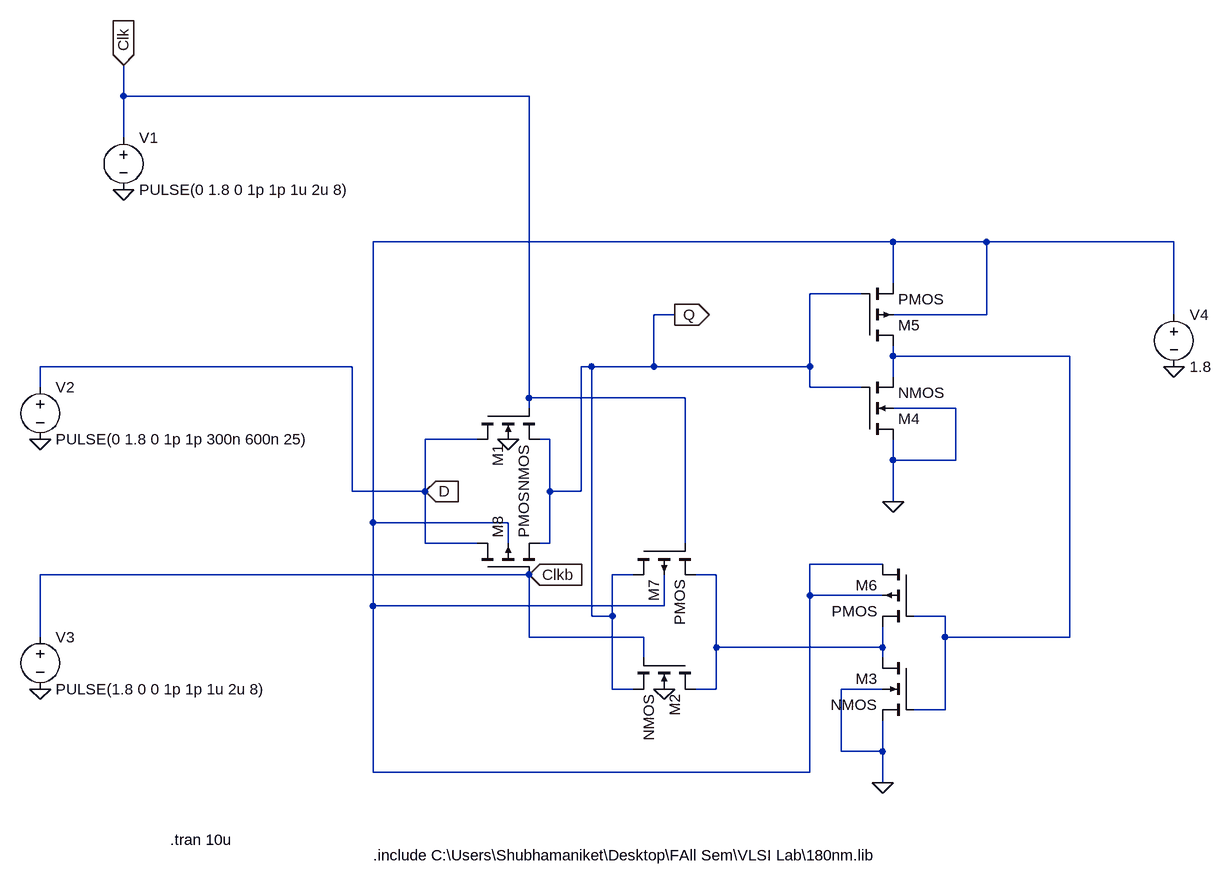
[diagram p0: schematic Task4Dlatch.asc]
Task4Dlatch.asc, the LTspice schematic file:
Version 4
SHEET 1 1344 680
WIRE -656 -592 -656 -640
WIRE -32 -592 -656 -592
WIRE -656 -528 -656 -592
WIRE 528 -368 -272 -368
WIRE 672 -368 528 -368
WIRE 960 -368 672 -368
WIRE 528 -304 528 -368
WIRE 480 -288 400 -288
WIRE 192 -256 160 -256
WIRE 672 -256 672 -368
WIRE 672 -256 528 -256
WIRE 960 -256 960 -368
WIRE 528 -192 528 -208
WIRE 800 -192 528 -192
WIRE -304 -176 -784 -176
WIRE 64 -176 48 -176
WIRE 160 -176 160 -256
WIRE 160 -176 64 -176
WIRE 400 -176 400 -288
WIRE 400 -176 160 -176
WIRE 528 -160 528 -192
WIRE -784 -144 -784 -176
WIRE 400 -144 400 -176
WIRE 480 -144 400 -144
WIRE -32 -128 -32 -592
WIRE 208 -128 -32 -128
WIRE -32 -112 -32 -128
WIRE 624 -112 528 -112
WIRE -112 -64 -192 -64
WIRE 0 -64 -16 -64
WIRE 528 -32 528 -64
WIRE 624 -32 624 -112
WIRE 624 -32 528 -32
WIRE -304 16 -304 -176
WIRE -192 16 -192 -64
WIRE -192 16 -304 16
WIRE 0 16 0 -64
WIRE 48 16 48 -176
WIRE 48 16 0 16
WIRE 528 32 528 -32
WIRE -272 64 -272 -368
WIRE -64 64 -272 64
WIRE -192 96 -192 16
WIRE -112 96 -192 96
WIRE -64 96 -64 64
WIRE 0 96 0 16
WIRE 0 96 -16 96
WIRE 208 96 208 -128
WIRE 512 128 400 128
WIRE -32 144 -784 144
WIRE 128 144 96 144
WIRE 256 144 224 144
WIRE 400 176 400 128
WIRE 512 176 400 176
WIRE -272 192 -272 64
WIRE 176 192 176 144
WIRE 176 192 -272 192
WIRE 64 208 64 -176
WIRE 96 208 96 144
WIRE 96 208 64 208
WIRE 608 208 560 208
WIRE -784 240 -784 144
WIRE -32 240 -32 144
WIRE 144 240 -32 240
WIRE 608 240 608 208
WIRE 800 240 800 -192
WIRE 800 240 608 240
WIRE 256 256 256 144
WIRE 512 256 512 224
WIRE 512 256 256 256
WIRE 144 272 144 240
WIRE 512 272 512 256
WIRE 96 320 96 208
WIRE 128 320 96 320
WIRE 256 320 256 256
WIRE 256 320 224 320
WIRE 512 320 448 320
WIRE 608 352 608 240
WIRE 608 352 560 352
WIRE 448 416 448 320
WIRE 512 416 512 368
WIRE 512 416 448 416
WIRE -272 448 -272 192
WIRE 400 448 400 176
WIRE 400 448 -272 448
WIRE 512 464 512 416
FLAG -64 -64 0
FLAG 176 320 0
FLAG 528 32 0
FLAG 512 464 0
FLAG -784 -64 0
FLAG -784 320 0
FLAG -656 -448 0
FLAG -192 16 D
IOPIN -192 16 In
FLAG -656 -640 Clk
IOPIN -656 -640 In
FLAG 960 -176 0
FLAG 192 -256 Q
IOPIN 192 -256 Out
FLAG -32 144 Clkb
IOPIN -32 144 In
SYMBOL nmos4 -112 -112 M90
SYMATTR InstName M1
SYMATTR Value2 l=180n w=1u
SYMBOL nmos4 224 272 R90
SYMATTR InstName M2
SYMATTR Value2 l=180n w=1u
SYMBOL nmos4 560 272 M0
SYMATTR InstName M3
SYMATTR Value2 l=180n w=1u
SYMBOL nmos4 480 -64 M180
SYMATTR InstName M4
SYMATTR Value2 l=180n w=1u
SYMBOL pmos4 480 -208 M180
SYMATTR InstName M5
SYMATTR Value2 l=180n w=1.87u
SYMBOL pmos4 560 128 M0
SYMATTR InstName M6
SYMATTR Value2 l=180n w=1.87u
SYMBOL pmos4 128 96 M90
SYMATTR InstName M7
SYMATTR Value2 l=180n w=1.87u
SYMBOL pmos4 -112 144 R270
SYMATTR InstName M8
SYMATTR Value2 l=180n w=1.87u
SYMBOL voltage -656 -544 R0
WINDOW 123 0 0 Left 0
WINDOW 39 0 0 Left 0
SYMATTR InstName V1
SYMATTR Value PULSE(0 1.8 0 1p 1p 1u 2u 8)
SYMBOL voltage -784 -160 R0
WINDOW 123 0 0 Left 0
WINDOW 39 0 0 Left 0
SYMATTR InstName V2
SYMATTR Value PULSE(0 1.8 0 1p 1p 300n 600n 25)
SYMBOL voltage -784 224 R0
WINDOW 123 0 0 Left 0
WINDOW 39 0 0 Left 0
SYMATTR InstName V3
SYMATTR Value PULSE(1.8 0 0 1p 1p 1u 2u 8)
SYMBOL voltage 960 -272 R0
WINDOW 123 0 0 Left 0
WINDOW 39 0 0 Left 0
SYMATTR InstName V4
SYMATTR Value 1.8
TEXT -584 552 Left 2 !.tran 10u
TEXT -272 576 Left 2 !.include C:\\Users\\Shubhamaniket\\Desktop\\FAll Sem\\VLSI Lab\\180nm.lib

The netlist it stands for:
* Task4Dlatch.asc
M1 D Clk Q 0 NMOS l=180n w=1u
M2 N003 Clkb Q 0 NMOS l=180n w=1u
M3 N003 N002 0 0 NMOS l=180n w=1u
M4 0 Q N002 0 NMOS l=180n w=1u
M5 N002 Q N001 N001 PMOS l=180n w=1.87u
M6 N001 N002 N003 N001 PMOS l=180n w=1.87u
M7 Q Clk N003 N001 PMOS l=180n w=1.87u
M8 D Clkb Q N001 PMOS l=180n w=1.87u
V1 Clk 0 PULSE(0 1.8 0 1p 1p 1u 2u 8)
V2 D 0 PULSE(0 1.8 0 1p 1p 300n 600n 25)
V3 Clkb 0 PULSE(1.8 0 0 1p 1p 1u 2u 8)
V4 N001 0 1.8
.model NMOS NMOS
.model PMOS PMOS
.lib standard.mos
.tran 10u
.include C:\Users\Shubhamaniket\Desktop\FAll Sem\VLSI Lab\180nm.lib
.backanno
.end